# Altium schematic sheet HPW_Protect.SchDoc: High-power Bus Protection
size A4; DrawnBy: Samyar Sadat Akhavi; Revision: 1.0; SheetNumber: 8; SheetTotal: 14
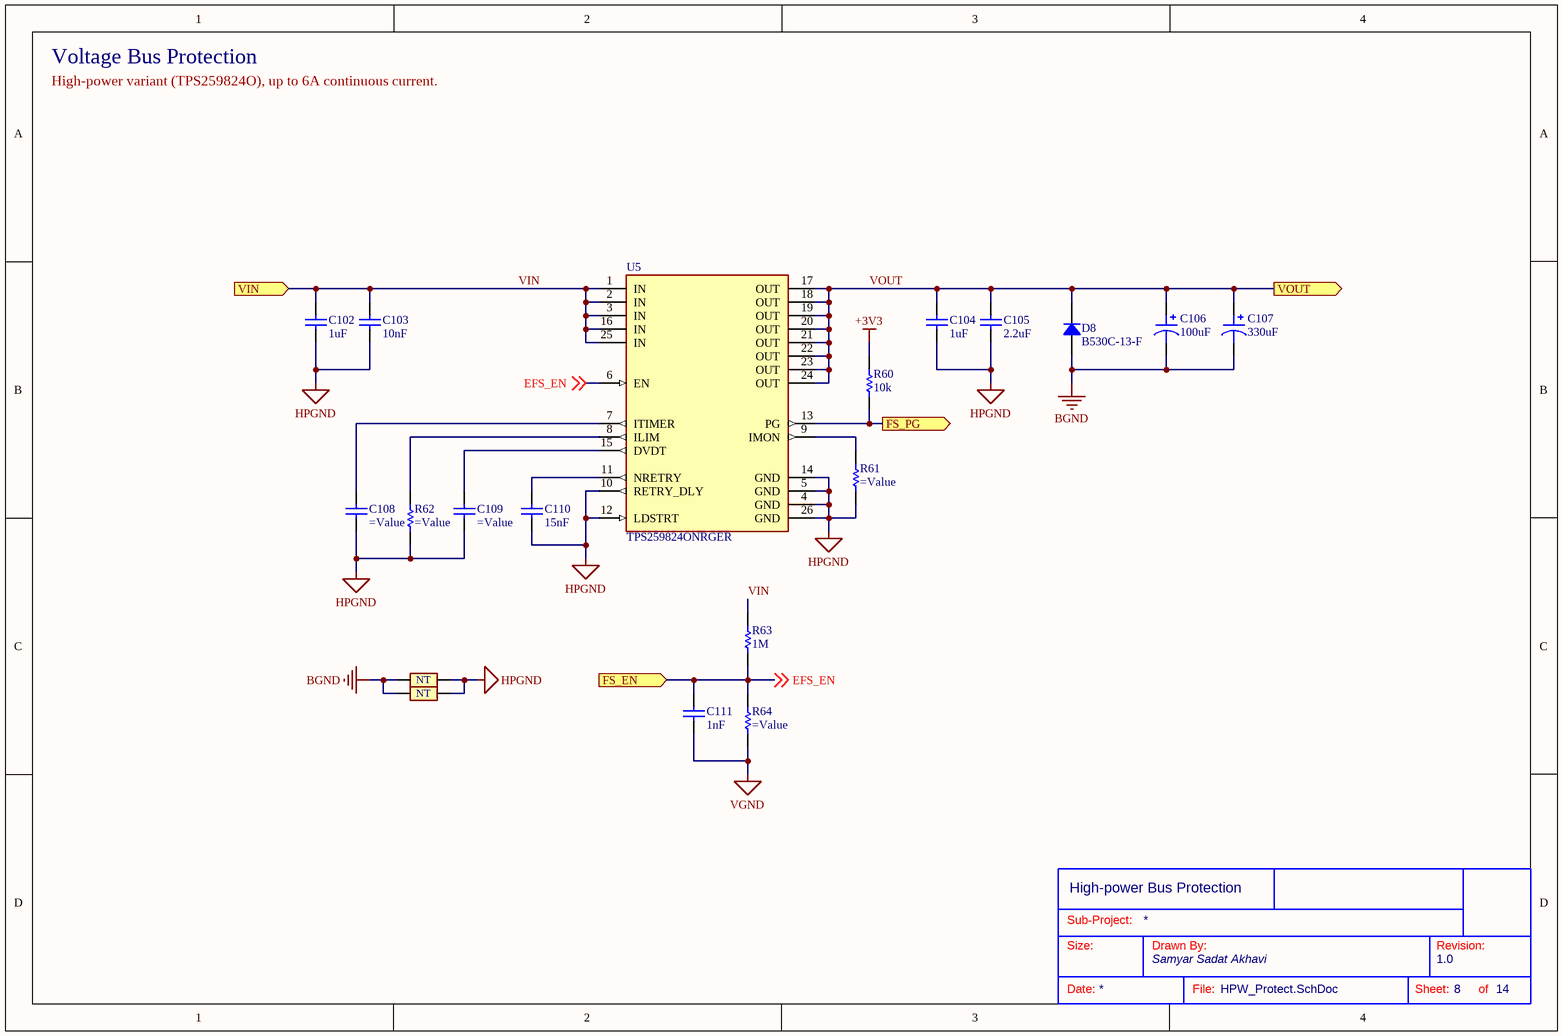
[diagram p0: HPW_Protect.SchDoc]

## Parts
?  (no value)  (graphical)
C102  1uF  [CAP_SMD_805]
C103  10nF  [CAP_SMD_603]
C104  1uF  [CAP_SMD_805]
C105  2.2uF  [CAP_SMD_805]
C106  100uF  [CAP ALSMD 6.6MM H5.4MM]
C107  330uF  [CAP ALSMD 8.3MM H10.5MM]
C108  (no value)  [CAP_SMD_603]
C109  (no value)  [CAP_SMD_603]
C110  15nF  [CAP_SMD_603]
C111  1nF  [CAP_SMD_603]
D8  B530C-13-F  [DO214AB SMC]
NT10  Net_Tie  [Net_Tie_Via]  (value not drawn)  (net tie, no BOM)
NT11  Net_Tie  [Net_Tie_Via]  (value not drawn)  (net tie, no BOM)
R60  10k  [RES_0603]
R61  (no value)  [RES_0603]
R62  (no value)  [RES_0603]
R63  1M  [RES_0603]
R64  (no value)  [RES_0603]
U5  TPS259824ONRGER  [RGE24_2P5XP85X1P45_TEX]

## Ports
FS_EN (in, see Voltage_Regulators[3A]), FS_PG (out, see Voltage_Regulators[4A]), VIN (in, see Voltage_Regulators[3A]), VOUT (out, see Voltage_Regulators[4A])

## Nets
+3V3: R60.1
BGND: C106.2 C107.2 D8.1 NT10.2 NT11.2
HPGND: C102.1 C103.1 C104.1 C105.1 C108.1 C109.1 C110.1 NT10.1 NT11.1 R61.2 R62.2 U5.4(GND) U5.5(GND) U5.10(RETRY_DLY) U5.12(LDSTRT) U5.14(GND) U5.26(GND)
VGND: C111.1 R64.2
EFS_EN: C111.2 R63.2 R64.1 U5.6(EN) ; off-sheet EFS_EN, port FS_EN
FS_PG: R60.2 U5.13(PG) ; port FS_PG
VIN: C102.2 C103.2 R63.1 U5.1(IN) U5.2(IN) U5.3(IN) U5.16(IN) U5.25(IN) ; port VIN
VOUT: C104.2 C105.2 C106.1 C107.1 D8.2 U5.17(OUT) U5.18(OUT) U5.19(OUT) U5.20(OUT) U5.21(OUT) U5.22(OUT) U5.23(OUT) U5.24(OUT) ; port VOUT
NetC108_2: C108.2 U5.7(ITIMER)
NetC109_2: C109.2 U5.15(DVDT)
NetC110_2: C110.2 U5.11(NRETRY)
NetR61_1: R61.1 U5.9(IMON)
NetR62_1: R62.1 U5.8(ILIM)

## Notes on the sheet
- Voltage Bus Protection
- High-power variant (TPS259824O), up to 6A continuous current.
- Sub-Project:
- Size:
- Drawn By:
- Revision:
- Date:
- File:
- Sheet:
- of
- (in symbol Net_Tie) NT

## Library data of the parts
? = Standard Title Block
C102 C104 C105 C111 = Non-polar Capacitor: Generic Ceramic Capacitor; Voltage: 35
  C102 C104: Value: 1uF
  C105: Value: 2.2uF
  C111: Value: 1nF
C103 C108-C110 = Non-polar Capacitor: Generic Ceramic Capacitor; Voltage: 50
  C103: Value: 10nF
  C108: Value: =Citimer
  C109: Value: =CdVdT
  C110: Value: 15nF
C106 = 865080343009: CAP ALUM 100UF 20% 16V SMD; manufacturer: Würth Elektronik; Impedance: 520 mOhms; Lifetime @ Temp.: 2000 Hrs @ 105°C; Polarization: Polar; Ripple Current @ High Frequency: 255 mA @ 100 kHz; Ripple Current @ Low Frequency: 165.75 mA @ 120 Hz; Surface Mount Land Size: 0.260" L x 0.260" W (6.60mm x 6.60mm); Part Number: 865080343009; Applications: General Purpose; Capacitance: 100uF; componentlink1description: Datasheet; componentlink1url: https://katalog.we-online.de/pbs/datasheet/865080343009.pdf; componentlink2description: DigiKey Link; componentlink2url: https://www.digikey.com/en/products/detail/würth-elektronik/865080343009/5728014; Device Package: Radial, Can - SMD; Height - Seated (Max): 0.217" (5.50mm); lastupdated: 6/3/2024 7:53:35 PM; Lifecycle Status: Active; Minimum Order: 1; Mounting Type: Surface Mount; Operating Temperature: -55°C ~ 105°C; Package / Case: Radial, Can - SMD; packaging: TapeAndReel; partid: 8820; Part Status: Active; price: 0.16; series: WCAP-ASLI; Size / Dimension: 0.248" Dia (6.30mm); Supplier 1: DigiKey; Supplier Part Number 1: 732-8419-1-ND; Tolerance: ±20%; value: 100uF; Voltage - Rated: 16 V
C107 = 865080453014: CAP ALUM 330UF 20% 25V SMD; manufacturer: Würth Elektronik; Impedance: 200 mOhms; Lifetime @ Temp.: 2000 Hrs @ 105°C; Polarization: Polar; Ripple Current @ High Frequency: 570 mA @ 100 kHz; Ripple Current @ Low Frequency: 370.5 mA @ 120 Hz; Surface Mount Land Size: 0.327" L x 0.327" W (8.30mm x 8.30mm); Part Number: 865080453014; Applications: General Purpose; Capacitance: 330uF; componentlink1description: Datasheet; componentlink1url: https://katalog.we-online.de/pbs/datasheet/865080453014.pdf; componentlink2description: DigiKey Link; componentlink2url: https://www.digikey.com/en/products/detail/würth-elektronik/865080453014/5728037; Device Package: Radial, Can - SMD; Height - Seated (Max): 0.413" (10.50mm); lastupdated: 6/3/2024 8:15:49 PM; Lifecycle Status: Active; Minimum Order: 1; Mounting Type: Surface Mount; Operating Temperature: -55°C ~ 105°C; Package / Case: Radial, Can - SMD; packaging: TapeAndReel; partid: 7460; Part Status: Active; price: 0.37; series: WCAP-ASLI; Size / Dimension: 0.315" Dia (8.00mm); Supplier 1: DigiKey; Supplier Part Number 1: 732-8442-1-ND; Tolerance: ±20%; value: 330uF; Voltage - Rated: 25 V
D8 = B530C-13-F: DIODE SCHOTTKY 30V 5A SMC; Manufacturer: Diodes Incorporated; Capacitance @ Vr, F: 300pF @ 4V, 1MHz; Current - Reverse Leakage @ Vr: 500 µA @ 30 V; Speed: Fast Recovery =< 500ns, > 200mA (Io); Voltage - Forward (Vf) (Max) @ If: 550 mV @ 5 A; Part Number: B530C-13-F; ComponentLink1Description: Datasheet; ComponentLink1URL: https://www.diodes.com/assets/Datasheets/ds13012.pdf; ComponentLink2Description: DigiKey Link; ComponentLink2URL: https://www.digikey.com/en/products/detail/diodes-incorporated/B530C-13-F/768770; Current - Average Rectified (Io): 5A; Diode Type: Schottky; LastUpdated: 6/3/2024 7:54:13 PM; Lifecycle Status: Active; Minimum Order: 1; Mounting Type: Surface Mount; Operating Temperature - Junction: -55°C ~ 150°C; Package / Case: DO-214AB, SMC; Packaging: TapeAndReel; PartId: 1719; Part Status: Active; Price: 0.16; Series: -; Supplier 1: DigiKey; Supplier Part Number 1: B530C-FDICT-ND; Supplier Device Package: SMC; Voltage - DC Reverse (Vr) (Max): 30 V
NT10 NT11 = Net_Tie: Net Tie
R60-R64 = Resistor: Power: 1/8W
  R60: Value: 10k
  R61: Value: =Rimon
  R62: Value: =Rilm
  R63: Value: 1M
  R64: Value: =FsenR2
U5 = TPS259824ONRGER: 2.7-V to 24-V, 2.7-mÎ©, 15-A eFuse with hot-swap protection, Â±1.5% current monitor & adj. fault mgmt. 24-VQFN -40 to 125; Manufacturer_Name: Texas Instruments; Copyright: Copyright (C) 2025 Ultra Librarian. All rights reserved.; Manufacturer_Part_Number: TPS259824ONRGER; RefDes: RefDes; Type: Type